# EAGLE design esp8266-beacon (EAGLE 9.3.2)
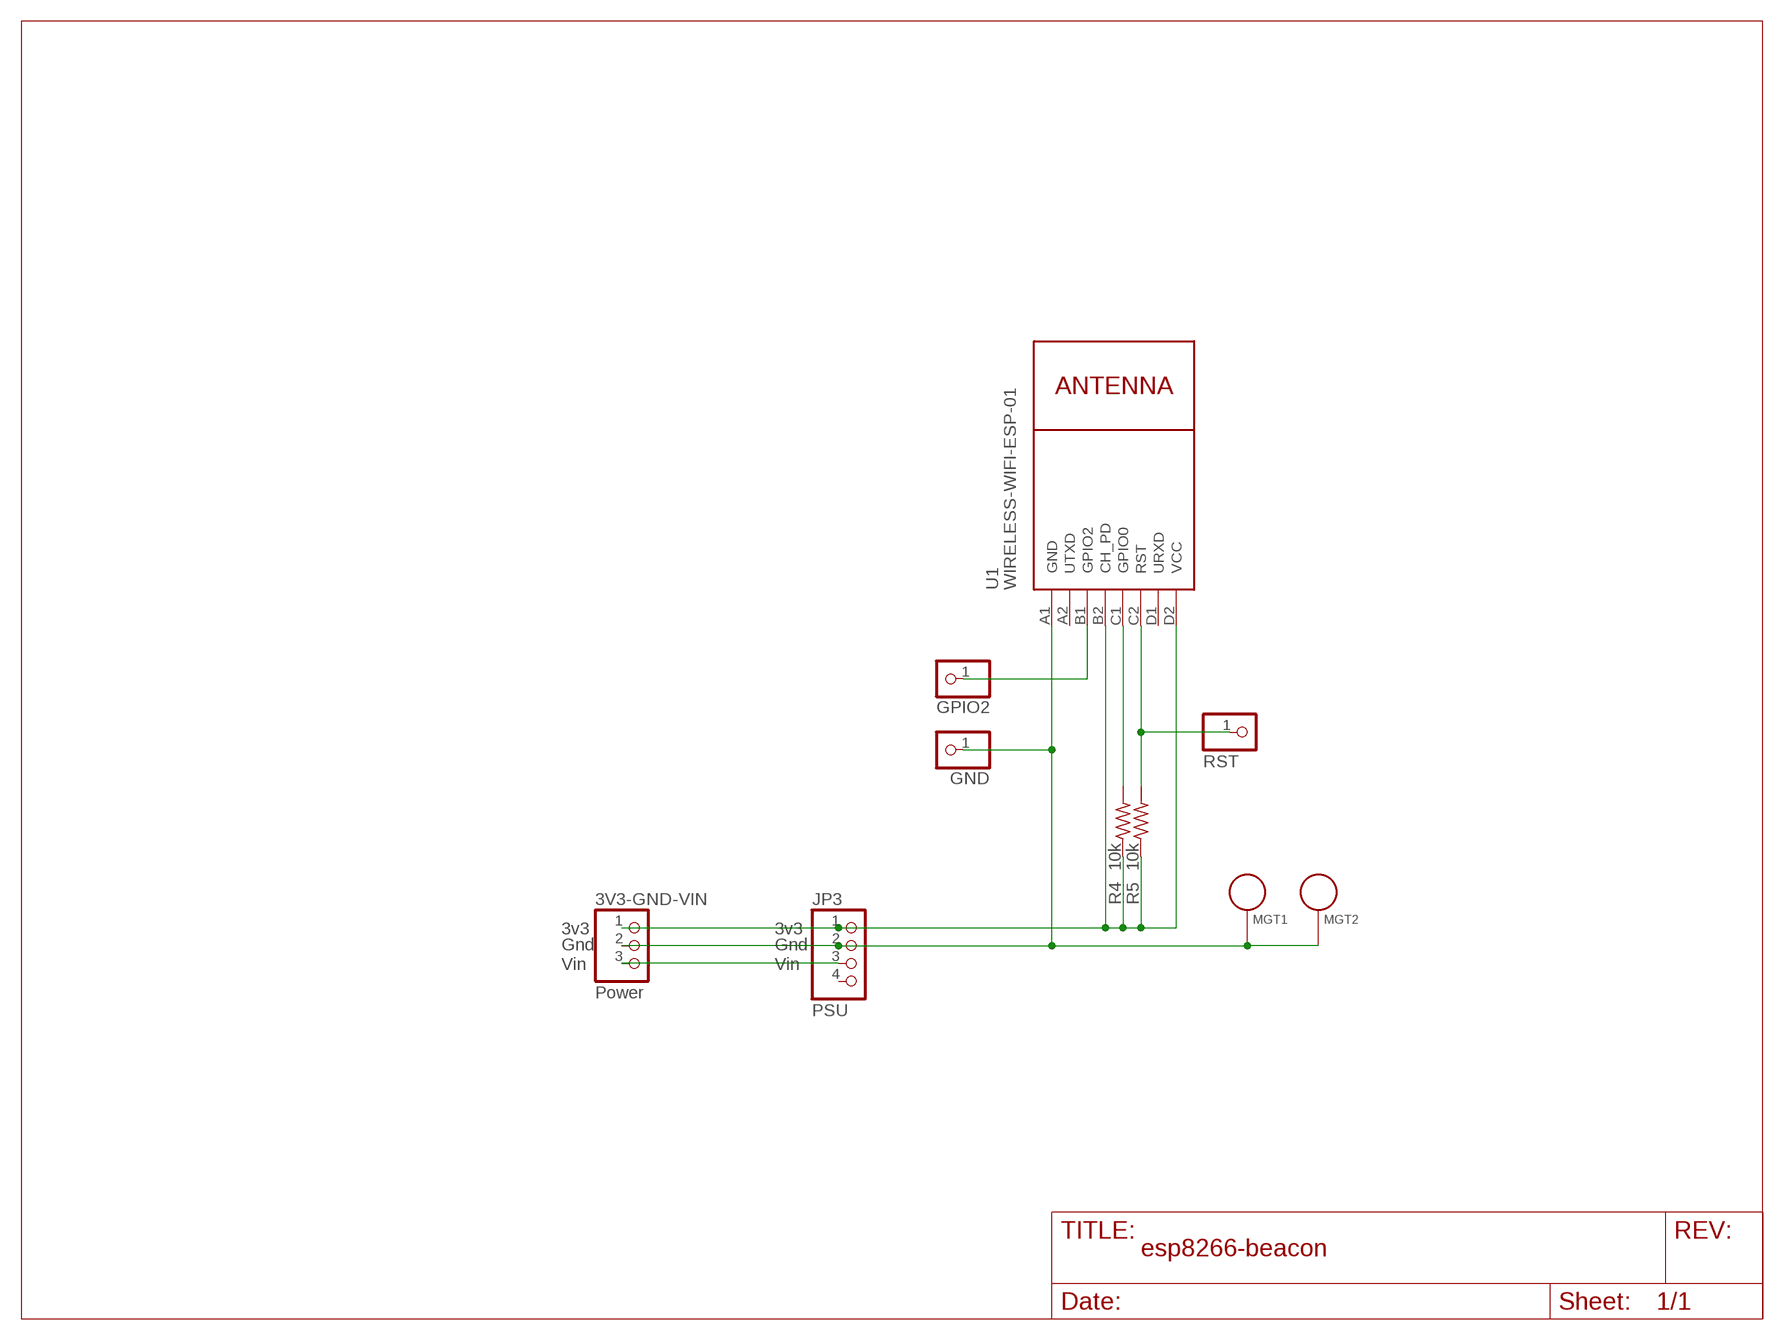
[diagram p0: schematic, sheet 1]

## Parts
3V3-GND-VIN  Power  PINHD-1X3  [1X03]
GND  RST  PINHD-1X1  [1X01]
GPIO2  RST  PINHD-1X1  [1X01]
JP3  PSU  PINHD-1X4  [1X04]
MGT1  BEAGLEBONEBLACK_MOUNTING_HOLE  [BEAGLEBONEBLACK_MOUNTING_HOLE]
MGT2  BEAGLEBONEBLACK_MOUNTING_HOLE  [BEAGLEBONEBLACK_MOUNTING_HOLE]
R4  10k  R-US_0207/10  [0207/10]
R5  10k  R-US_0207/10  [0207/10]
RST  RST  PINHD-1X1  [1X01]
U1  WIRELESS-WIFI-ESP-01  [WIRELESS-WIFI-ESP-01]

## Nets
3V3: 3V3-GND-VIN.1 JP3.1 R4.1 R5.1 U1.B2(CH_PD) U1.D2(VCC)
GND: 3V3-GND-VIN.2 GND.1 JP3.2 MGT1.P$1 MGT2.P$1 U1.A1(GND)
N$1: GPIO2.1 U1.B1(GPIO2)
N$3: 3V3-GND-VIN.3 JP3.3
N$4: R4.2 U1.C1(GPIO0)
N$5: R5.2 RST.1 U1.C2(RST)
Unconnected: JP3.4 U1.A2(UTXD) U1.D1(URXD)

## Notes on the sheet
- 3v3 | 3v3
- Gnd | Gnd
- Vin | Vin

## Library data of the parts
3V3-GND-VIN = pinhead:PINHD-1X3: PIN HEADER
GND GPIO2 RST = adafruit:PINHD-1X1: Pin header 1x1 for 0.1" spacing With round pins
JP3 = pinhead:PINHD-1X4: PIN HEADER
MGT1 MGT2 = BeagleBone_Black_Wireless:BEAGLEBONEBLACK_MOUNTING_HOLE: Chassis Mounting Hole w/GND connection ability
R4 R5 = BeagleBone_Black_Wireless:R-US_: RESISTOR, American symbol
U1 = diy-modules:WIRELESS-WIFI-ESP-01: Wireless Wi-Fi ESP-01 Module based on ESP8266 chip Click here to find device on ebay.com <http://www.ebay.com/sch/esp8266+esp+01+transceiver>

## Board
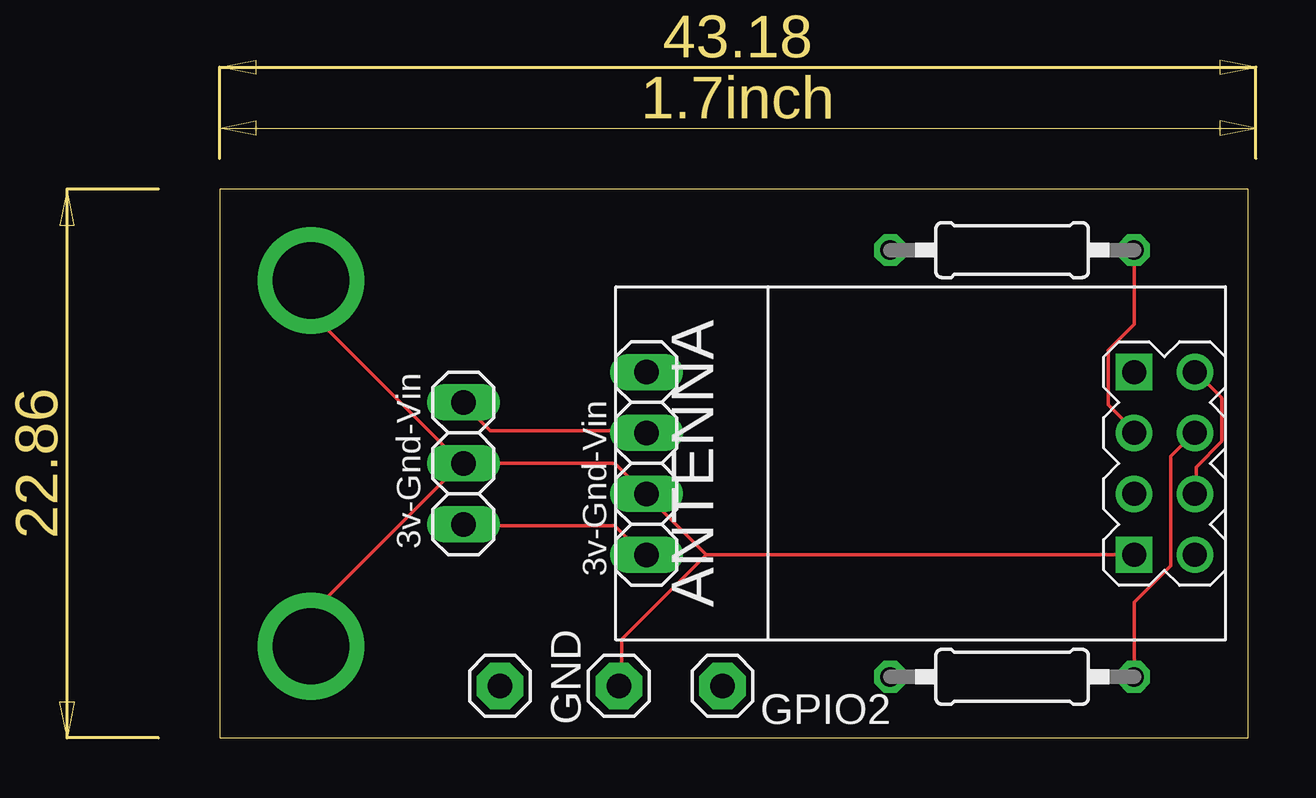
[diagram p1: board, top side]
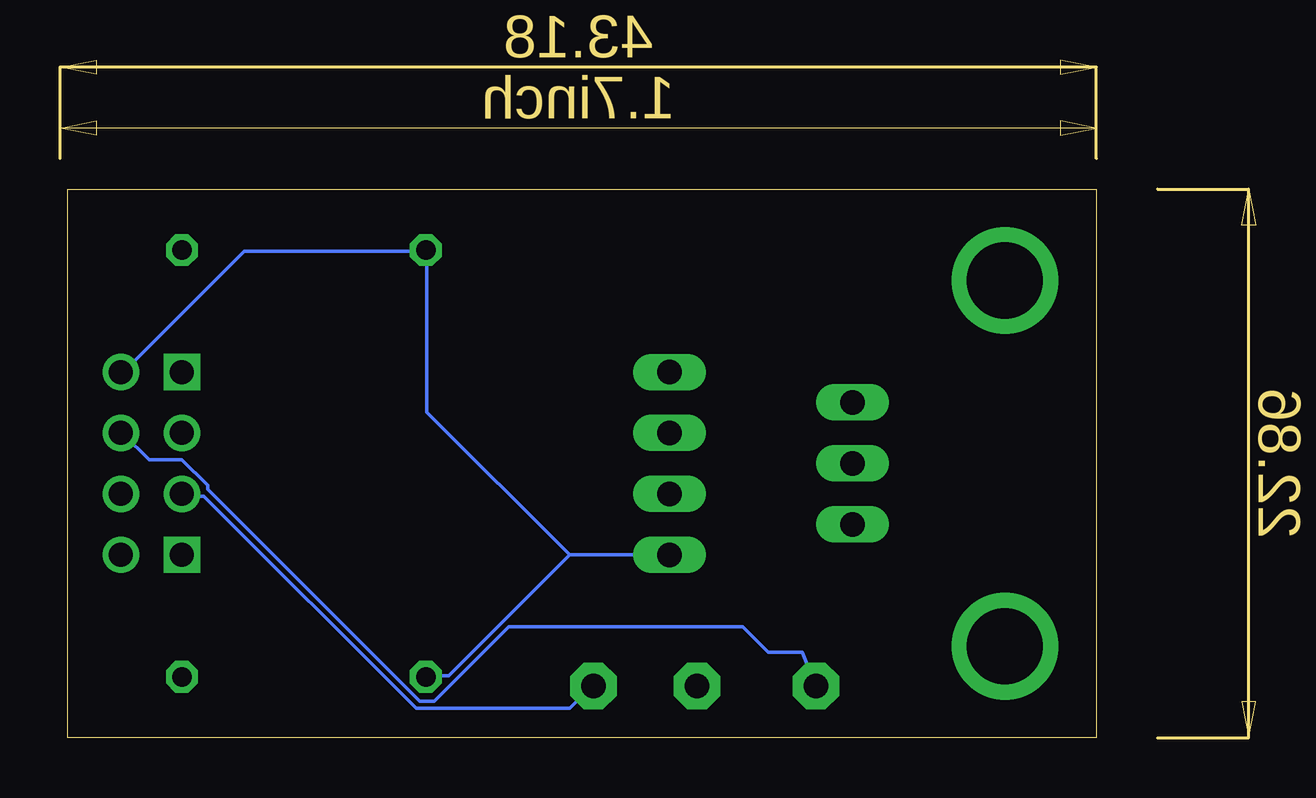
[diagram p2: board, bottom side, seen from below]

Size 42.85 x 22.85 mm. Coordinates in mm from the lower left corner, seen from the top.
Outline: 0,0 42.85,0 42.85,22.85 0,22.85 0,0
Copper layers (1*16): Top 0.035mm / dielectric 1.5mm / Bottom 0.035mm
Design rules "default": minimum track width 6mil, minimum drill 0.35mm, track to track 6mil, track to pad 6mil, pad to pad 6mil, via to via 6mil, smd to smd 6mil, copper to edge 40mil, drill to drill 6mil, minimum pad ring 10mil, minimum via ring 8mil, stop-mask expansion 4mil, vias tented up to drill 0mil, thermal gap 10mil

### Footprints (pad centres in the part's own frame; a part is rotated, then mirrored left to right if it is on the bottom)
1X03 = drill 1.016 long: 1 -2.54,0; 2 0,0; 3 2.54,0
1X01 = drill 1.016 pad 1.93 octagon: 1 0,0
1X04 = drill 1.016 long: 1 -3.81,0; 2 -1.27,0; 3 1.27,0; 4 3.81,0
BEAGLEBONEBLACK_MOUNTING_HOLE = drill 3.175 pad 4.445: P$1 0,0
0207/10 = drill 0.813 octagon: 1 -5.08,0; 2 5.08,0
WIRELESS-WIFI-ESP-01 = drill 1 square: A1 -8.89,3.81; D1 -8.89,-3.81 | drill 1: A2 -11.43,3.81; B1 -8.89,1.27; B2 -11.43,1.27; C1 -8.89,-1.27; C2 -11.43,-1.27; D2 -11.43,-3.81

### Placement (x,y rotation side)
3V3-GND-VIN  10.16,11.43 90 top
GND  16.64,2.16 0 top
GPIO2  20.95,2.16 0 top
JP3  17.78,11.43 90 top
MGT1  3.81,19.05 0 top
MGT2  3.81,3.81 0 top
R4  33.02,20.32 0 top
R5  33.02,2.54 0 top
RST  11.68,2.16 0 top
U1  29.21,11.43 180 top

### Tracks (layer width: path | path; a pad name or v marks a point on that pad's centre or on a via)
3V3
  Top 0.152: U1.B2 40.69,10.21 40.69,11.28 41.76,12.34 41.76,14.17 40.69,15.24 U1.D2 | 3V3-GND-VIN.1 10.21,8.84 16.46,8.84 17.68,7.62 JP3.1
  Bottom 0.152: U1.D2 40.54,15.24 35.51,20.27 28.04,20.27 R4.1 27.89,20.27 27.89,13.56 21.95,7.62 | 21.95,7.62 26.98,2.59 27.89,2.59 R5.1 | JP3.1 21.95,7.62
GND
  Top 0.152: 20.27,7.62 U1.A1 | 20.27,7.62 17.83,10.06 JP3.2 17.68,10.21 16.46,11.43 3V3-GND-VIN.2 10.06,11.43 | 20.27,7.62 16.76,4.12 16.76,2.29 GND.1 | MGT2.P$1 3.81,5.18 10.06,11.43 | MGT1.P$1 3.81,17.68 10.06,11.43
N$1
  Bottom 0.152: U1.B1 38.1,10.06 37.19,10.06 28.35,1.22 21.95,1.22 21.03,2.13 GPIO2.1
N$3
  Top 0.152: JP3.3 17.68,12.8 11.28,12.8 10.21,13.87 3V3-GND-VIN.3
N$4
  Top 0.152: R4.2 38.1,17.22 37.03,16.15 37.03,13.87 38.1,12.8 U1.C1
N$5
  Top 0.152: R5.2 38.1,5.64 39.62,7.16 39.62,11.73 40.54,12.65 U1.C2
  Bottom 0.152: RST.1 12.24,3.56 13.66,3.56 14.73,4.62 24.49,4.62 27.58,1.52 28.19,1.52 37.03,10.36 37.03,10.52 38.1,11.58 39.47,11.58 40.54,12.65 U1.C2

### Text on the board
tNames: 3v-Gnd-Vin | 3v-Gnd-Vin